# Altium schematic sheet Taxi.SchDoc
size A4
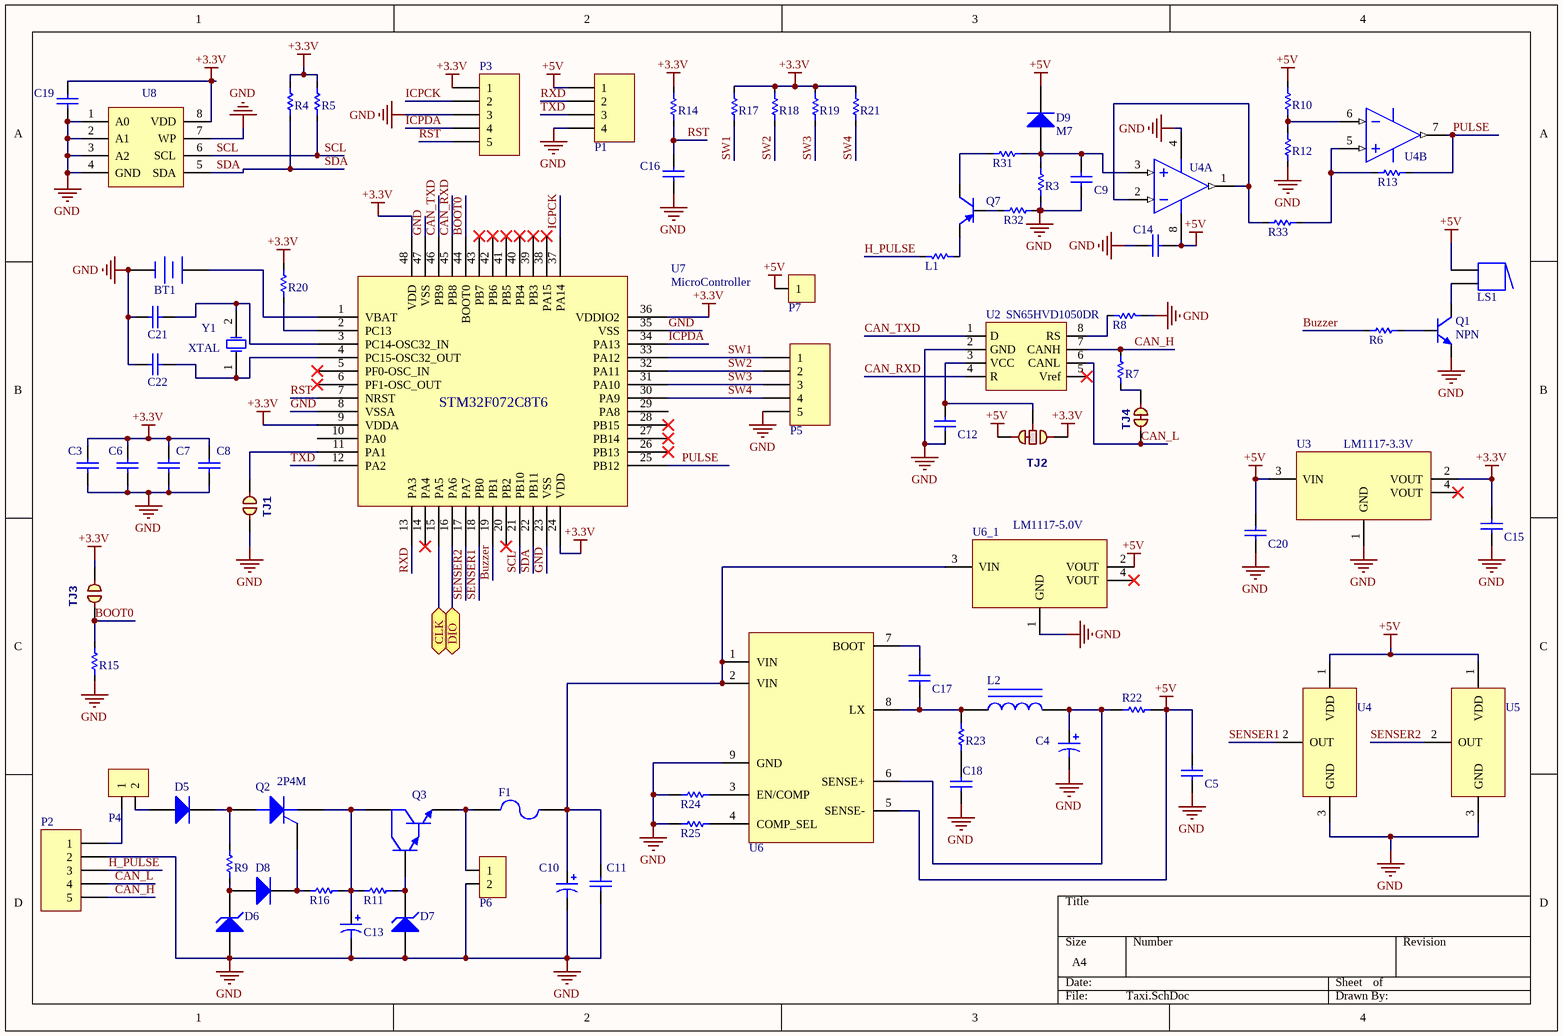
[diagram p0: Taxi.SchDoc]

## Parts
(Parts that share a designator on the sheet are numbered #1, #2 ... from top to bottom, then left to right.)
BT1  CR2032 3V  [Battery Holder(CR2032)]  (value not drawn)
C3  0.1uF/10V  [C0603]  (value not drawn)
C4  220uF/16V  [C220uF25V]  (value not drawn)
C5  0.1uF  [C0603]  (value not drawn)
C6  0.1uF/10V  [C0603]  (value not drawn)
C7  0.1uF/10V  [C0603]  (value not drawn)
C8  0.1uF/10V  [C0603]  (value not drawn)
C9  0.1uF  [C0603]  (value not drawn)
C10  1500uF/25V  [C1000uF25V]  (value not drawn)
C11  0.1uF/50V  [C0805]  (value not drawn)
C12  0.1uF/50V  [C0603]  (value not drawn)
C13  1000uF/50V  [C1000uF50V]  (value not drawn)
C14  0.1uF  [C0603]  (value not drawn)
C15  0.1uF/50V  [C0603]  (value not drawn)
C16  0.1uF/10V  [C0603]  (value not drawn)
C17  0.1uF/50V  [C0603]  (value not drawn)
C18  3.3nF  [C0603]  (value not drawn)
C19  0.1uF/10V  [C0603]  (value not drawn)
C20  0.1uF/50V  [C0603]  (value not drawn)
C21  0.1uF/50V  [C0603]  (value not drawn)
C22  0.1uF/50V  [C0603]  (value not drawn)
D5  M7  [DO-241]  (value not drawn)
D6  12V Zener  [LL-41]  (value not drawn)
D7  12V Zener  [LL-41]  (value not drawn)
D8  M7  [DO-241]  (value not drawn)
D9  M7  [SMA]
F1  500mA PTC  [1812(PTC Fuse)]  (value not drawn)
L1  Res1  [R0603]  (value not drawn)
L2  22uH  [Ferrite_Coil_22uH]  (value not drawn)
LS1  Buzzer 5V  [Buzzer]  (value not drawn)
P1  Header 4X1  [HDR1X4]  (value not drawn)
P2  Header 5X1  [Connector_508_5pin]  (value not drawn)
P3  Header 5X1  [HDR1X5]  (value not drawn)
P4  Header 2X1  [HDR1X2_2515]  (value not drawn)
P5  Header 5  [HDR1X5_2515]  (value not drawn)
P6  Header 2X1  [HDR1X2_2515]  (value not drawn)
P7  Header 1X1  [HDR1X1]  (value not drawn)
Q1  NPN  [SOT-23]
Q2  2P4M  [DPAK_SOT423_252]
Q3  TIP122  [DPAK_SOT423_252]  (value not drawn)
Q7  BC857  [SOT-23]  (value not drawn)
R3  10K  [R0603]  (value not drawn)
R4  Res1  [R0603]  (value not drawn)
R5  Res1  [R0603]  (value not drawn)
R6  Res1  [R0603]  (value not drawn)
R7  120R  [R0603]  (value not drawn)
R8  0R  [R0603]  (value not drawn)
R9  Res1  [R1206]  (value not drawn)
R10  10K  [R0603]  (value not drawn)
R11  Res1  [R1206]  (value not drawn)
R12  2K2  [R0603]  (value not drawn)
R13  100K  [R0603]  (value not drawn)
R14  1K  [R0603]  (value not drawn)
R15  Res1  [R0603]  (value not drawn)
R16  Res1  [R1206]  (value not drawn)
R17  1K  [R0603]  (value not drawn)
R18  1K  [R0603]  (value not drawn)
R19  1K  [R0603]  (value not drawn)
R20  1K  [R0603]  (value not drawn)
R21  1K  [R0603]  (value not drawn)
R22  0R062  [R1206]  (value not drawn)
R23  3R3  [R0603]  (value not drawn)
R24  DNP  [R0603]  (value not drawn)
R25  DNP  [R0603]  (value not drawn)
R31  4K7  [R0603]  (value not drawn)
R32  10K  [R0603]  (value not drawn)
R33  2K2  [R0603]  (value not drawn)
TJ1  JUMPER-PAD-2-NO_BY_TRACE  [PAD_JUMPER_2_NO]  (value not drawn)  (no BOM)
TJ2  (no value)  [PAD_JUMPER_3_12NC]  (no BOM)
TJ3  JUMPER-PAD-2-NO_BY_TRACE  [PAD_JUMPER_2_NO]  (value not drawn)  (no BOM)
TJ4  (no value)  [PAD_JUMPER_2_NC]  (no BOM)
U2  SN65HVD1050DR  [SOIC-8N]
U3  LM1117-3.3V  [SOT223]
U4#1  LM393  [SOIC-8N]  (value not drawn)  (parts A,B of 2)
U4#2  Hall effect Switch  [SOT-23 - Sensor]  (value not drawn)
U5  Hall effect Switch  [SOT-23 - Sensor]  (value not drawn)
U6  uP9601TSW8  [SO PowerPAD]  (value not drawn)
U6_1  LM1117-5.0V  [SOT223]
U7  MicroController  [TQFP48]
U8  24C02  [SOIC-8N]  (value not drawn)
Y1  XTAL  [Craystal_Radial_2x6]

## Ports
CLK (bidir), DIO (bidir)

## Nets
+3.3V: C3.2 C6.2 C7.2 C8.2 C15.2 C19.1 P3.1 R4.2 R5.2 R14.2 R17.2 R18.2 R19.2 R20.2 R21.2 TJ2.3 TJ3.2 U3.2(VOUT) U7.9(VDDA) U7.24(VDD) U7.36(VDDIO2) U7.48(VDD) U8.8(VDD)
+5V: C5.2 C14.2 C20.2 D9.2(K) LS1.1 P1.1 P7.1 R10.2 R22.2 TJ2.1 U3.3(VIN) U4#1.8(VCC) U4#2.1(VDD) U5.1(VDD) U6.5(SENSE-) U6_1.2(VOUT)
GND: BT1.2(-) C3.1 C4.2 C5.1 C6.1 C7.1 C8.1 C9.2 C10.2 C11.1 C12.1 C13.2 C14.1 C15.1 C16.2 C18.1 C19.2 C20.1 C21.2 C22.2 D6.1(A) D7.1(A) P1.4 P2.2 P3.3 P5.5 P6.2 Q1.2(E) R3.2 R8.2 R12.2 R15.2 R24.1 R25.1 R32.1 TJ1.1 U2.2(GND) U3.1(GND) U4#1.4(GND) U4#2.3(GND) U5.3(GND) U6.9(GND) U6_1.1(GND) U7.8(VSSA) U7.23(VSS) U7.35(VSS) U7.47(VSS) U8.1(A0) U8.2(A1) U8.3(A2) U8.4(GND) U8.7(WP)
BOOT0: R15.1 TJ3.1 U7.44(BOOT0)
Buzzer: R6.2 U7.19(PB1)
CAN_H: P2.5 R7.2 U2.7(CANH)
CAN_L: P2.4 TJ4.1 U2.6(CANL)
CAN_RXD: U2.4(R) U7.45(PB8)
CAN_TXD: U2.1(D) U7.46(PB9)
CLK: U7.15(PA5) ; port CLK
DIO: U7.16(PA6) ; port DIO
H_PULSE: L1.1 P2.3
ICPCK: P3.2 U7.37(PA14)
ICPDA: P3.4 U7.34(PA13)
PULSE: R13.1 U4#1.7(OUT) U7.25(PB12)
RST: C16.1 P3.5 R14.1 U7.7(NRST)
RXD: P1.2 U7.13(PA3)
SCL: R5.1 U7.21(PB10) U8.6(SCL)
SDA: R4.1 U7.22(PB11) U8.5(SDA)
SENSER1: U4#2.2(OUT) U7.18(PB0)
SENSER2: U5.2(OUT) U7.17(PA7)
SW1: P5.1 R17.1 U7.33(PA12)
SW2: P5.2 R18.1 U7.32(PA11)
SW3: P5.3 R19.1 U7.31(PA10)
SW4: P5.4 R21.1 U7.30(PA9)
TXD: P1.3 U7.12(PA2)
NetBT1_1: BT1.1(+) U7.1(VBAT)
NetC4_1: C4.1 L2.2 R22.1 U6.6(SENSE+)
NetC9_1: C9.1 D9.1(A) R3.1 R31.1 U4#1.3(IN+)
NetC10_1: C10.1 C11.2 F1.2 U6.1(VIN) U6.2(VIN) U6_1.3(VIN)
NetC12_2: C12.2 TJ2.2 U2.3(VCC)
NetC13_1: C13.1 Q2.1(K) Q3.4(C) R11.2 R16.1
NetC17_1: C17.1 U6.7(BOOT)
NetC17_2: C17.2 L2.1 R23.2 U6.8(LX)
NetC18_2: C18.2 R23.1
NetC21_1: C21.1 U7.3(PC14-OSC32_IN) Y1.2(OSC2)
NetC22_1: C22.1 U7.4(PC15-OSC32_OUT) Y1.1(OSC1)
NetD5_1: D5.1(A) P4.2
NetD5_2: D5.2(K) Q2.4(A) R9.2
NetD6_2: D6.2(K) D8.1(A) R9.1
NetD7_2: D7.2(K) Q3.1(B) R11.1
NetD8_2: D8.2(K) Q2.3(G) R16.2
NetF1_1: F1.1 P6.1 Q3.3(E)
NetL1_2: L1.2 Q7.2
NetLS1_2: LS1.2 Q1.3(C)
NetP2_1: P2.1 P4.1
NetQ1_1: Q1.1(B) R6.1
NetQ7_1: Q7.1(B) R32.2
NetQ7_3: Q7.3(C) R31.2
NetR7_1: R7.1 TJ4.1
NetR8_1: R8.1 U2.8(RS)
NetR10_1: R10.1 R12.1 U4#1.6(IN-)
NetR13_2: R13.2 R33.2 U4#1.5(IN+)
NetR20_1: R20.1 U7.2(PC13)
NetR24_2: R24.2 U6.3(EN/COMP)
NetR25_2: R25.2 U6.4(COMP_SEL)
NetR33_1: R33.1 U4#1.1(OUT) U4#1.2(IN-)
NetTJ1_2: TJ1.2 U7.11(PA1)

Not connected (* = marked no-connect by the designer): U2 5(Vref)*; U3 4(VOUT)*; U6_1 4(VOUT)*; U7 5(PF0-OSC_IN)* 6(PF1-OSC_OUT)* 10(PA0) 14(PA4)* 20(PB2)* 26(PB13)* 27(PB14)* 28(PB15)* 29(PA8) 38(PA15)* 39(PB3)* 40(PB4)* 41(PB5)* 42(PB6)* 43(PB7)*

## Library data of the parts
BT1 = Battery: Cell Battery; Published: 24-Mar-1999; LatestRevisionDate: 17-Jul-2002; LatestRevisionNote: Re-released for DXP Platform.; PackageReference: BAT-2; Publisher: Altium Limited; PackageDescription: Battery; 2 Leads
C3 C5-C9 C11 C14-C22 = Capacitor_Ceramic
  C3 C6-C9 C11 C14-C16 C19-C22: Value: *
C4 C10 C13 = Capacitor_Electrolytic
C12 = Capacitor_Ceramic: Manufacturer Part Number: TCC0603X7R104K500CT; Value: 0.1uF/50V; Case/Package: C0603; Mount: Yes
D5 D8 D9 = Diode
D6 D7 = D Zener: Zener Diode; Published: 8-Jun-2000; LatestRevisionDate: 17-Jul-2002; LatestRevisionNote: Re-released for DXP Platform.; PackageReference: DIODE-0.7; Publisher: Altium Limited; PackageDescription: Diode, Thru-Hole; 2 Leads; 0.7 in Pin Spacing
F1 = Fuse
L1 R3-R6 R9-R13 R15 R16 R22 R23 R31-R33 = Res1: Resistor; Value: 1K; Published: 8-Jun-2000; LatestRevisionDate: 17-Jul-2002; LatestRevisionNote: Re-released for DXP Platform.; PackageReference: AXIAL-0.3; Publisher: Altium Limited; PackageDescription: Axial Device, Thru-Hole; 2 Leads; 0.3 in Pin Spacing
L2 = Ferrite_Coil
LS1 = Buzzer: Magnetic Transducer Buzzer; Published: 24-Mar-1999; LatestRevisionDate: 17-Dec-2003; LatestRevisionNote: Schematic revised, PCB Footprint replaced.; DatasheetVersion: 17-Dec-2003; PackageReference: ABSM-1574; Publisher: Altium Limited; PackageDescription: Magnetic Transducer Buzzer; ComponentLink1Description: Manufacturer Link; ComponentLink1URL: http://www.megastar.com/linecard/buzzmode/index.php
P1 = Header 4: Header, 4-Pin; LatestRevisionDate: 17-Jul-2002; LatestRevisionNote: Re-released for DXP Platform.; Publisher: Altium Limited
P2 P3 P5 = Header 5: Header, 5-Pin; LatestRevisionDate: 17-Jul-2002; LatestRevisionNote: Re-released for DXP Platform.; Publisher: Altium Limited
Q2 = SCR: Silicon Controlled Rectifier; Published: 8-Jun-2000; LatestRevisionDate: 17-Jul-2002; LatestRevisionNote: Re-released for DXP Platform.; PackageReference: TO-220-AB; Publisher: Altium Limited; Code_JEDEC: TO-220-AB
Q3 = NPN1: NPN Darlington Bipolar Transistor; Published: 8-Jun-2000; LatestRevisionDate: 17-Jul-2002; LatestRevisionNote: Re-released for DXP Platform.; DatasheetVersion: 1989; PackageVersion: 1989; PackageReference: TO-92; Publisher: Altium Limited; PackageDescription: TO, Flat Index; 3 In-Line, Axial Leads; Body Dia. 4.6mm; Leads 0.41 x 0.39 mm (max); Code_JEDEC: TO-92
Q7 = PNP
R7 = Res1: Resistor; Manufacturer Part Number: RC0603FR-07120RL; Value: 120R; Case/Package: R0603
R8 = Res1: Resistor; Manufacturer Part Number: RC0603FR-070RL; Value: 0R; Case/Package: R0603; Mount: Yes
R14 R17-R21 R24 R25 = Res1: Resistor; Published: 8-Jun-2000; LatestRevisionDate: 17-Jul-2002; LatestRevisionNote: Re-released for DXP Platform.; PackageReference: AXIAL-0.3; Publisher: Altium Limited; PackageDescription: Axial Device, Thru-Hole; 2 Leads; 0.3 in Pin Spacing
  R14 R17-R21: Value: 1K
  R24 R25: Value: DNP
TJ2 = JUMPER-PAD-3-1OF2_NC_BY_TRACE_SMALL
TJ4 = JUMPER-PAD-2-NC_BY_TRACE
U2 = SN65HVD230: CAN Transceiver; Case/Package: SOIC-8; Manufacturer Part Number: SN65HVD1050DR; Mount: Yes; Value: SN65HVD1050DR
U3 U6_1 = LM1117
U4#1 = LM158
U4#2 U5 = AH1802
U6 = uP9601T: DC-to-DC Converter Control Circuit; Published: 15-Apr-2002; LatestRevisionDate: 13-Apr-2006; LatestRevisionNote: IPC-7351 Footprint Added.; DatasheetVersion: 1996; PackageVersion: 1998; PackageReference: 751-05; Publisher: Altium Limited; PackageDescription: 8-Pin Small Outline Integrated Circuit 1.27 mm Pitch; Code_JEDEC: MS-012-AA; Code_IPC: SOIC127P600-8; ComponentLink1Description: Manufacturer Link; ComponentLink1URL: http://www.onsemi.com/site/products/taxonomy/0,4438,503,00.html; ComponentLink2Description: Datasheet; ComponentLink2URL: http://www.onsemi.com/pub/Collateral/MC34063A-D.PDF
U7 = STM32F072C8T6
U8 = 24Cxx
Y1 = XTAL: Crystal Oscillator; Published: 8-Jun-2000; LatestRevisionDate: 17-Jul-2002; LatestRevisionNote: Re-released for DXP Platform.; PackageReference: R38; Publisher: Altium Limited; PackageDescription: Crystal, Thru-Hole; 2 Leads; Body 3.1 x 8.2 mm (Dia.xH)